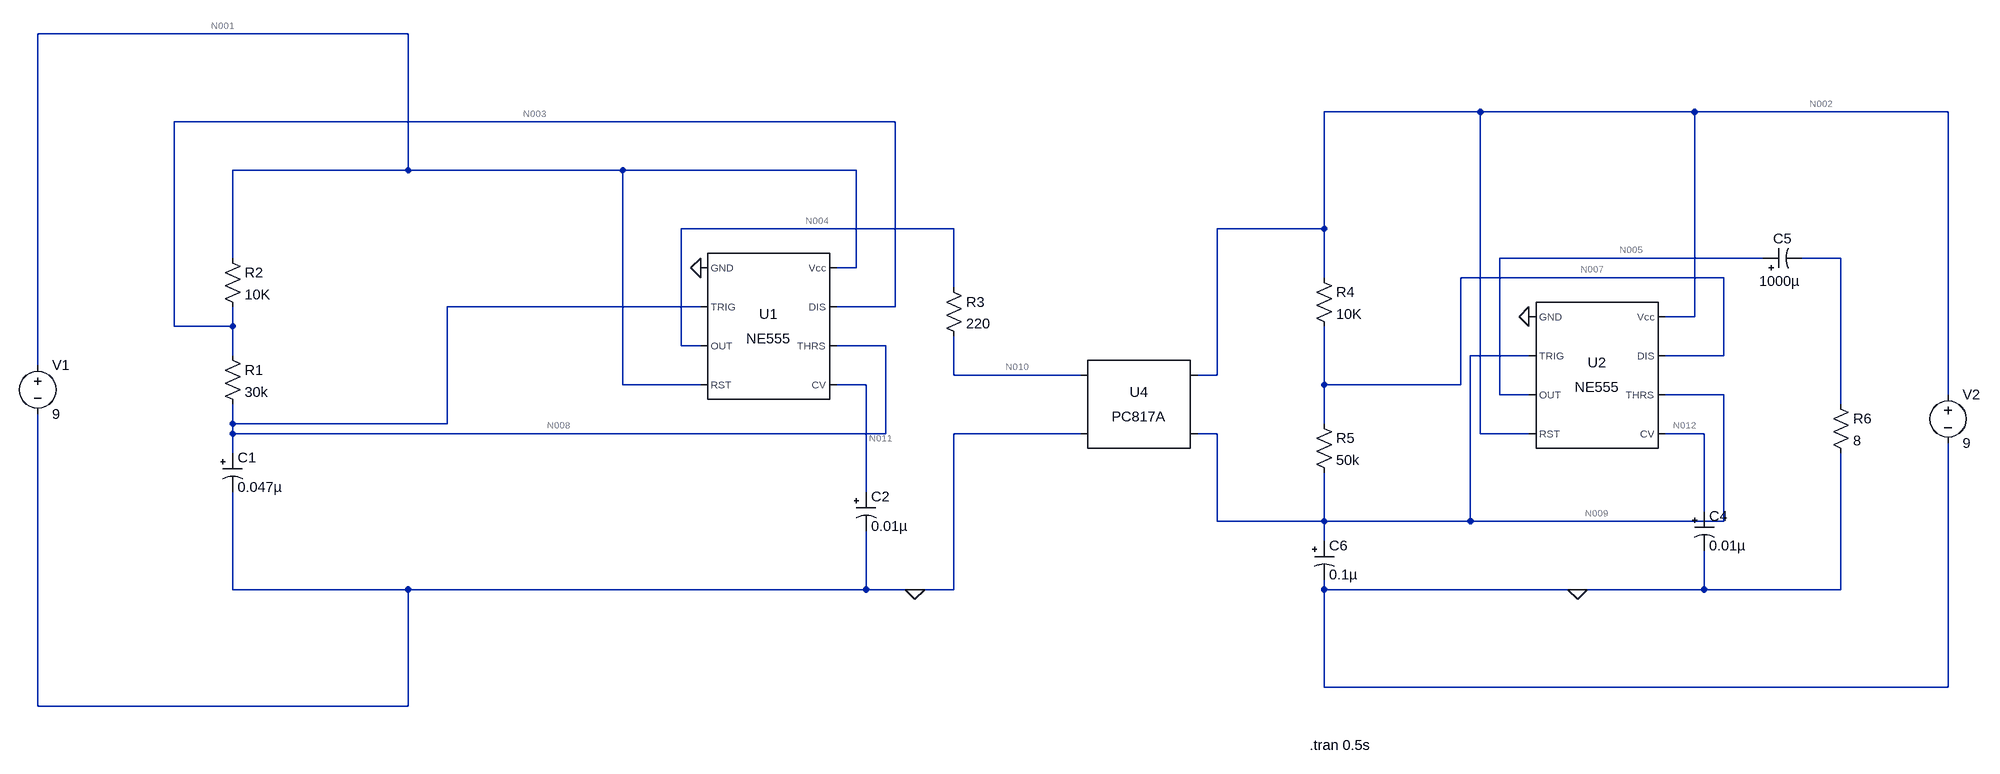
[diagram p0: schematic KR.asc]
KR.asc, the LTspice schematic file:
Version 4
SHEET 1 2916 848
WIRE -800 -336 -1408 -336
WIRE 960 -208 704 -208
WIRE 1312 -208 960 -208
WIRE 1728 -208 1312 -208
WIRE 0 -192 -1184 -192
WIRE -800 -112 -800 -336
WIRE -800 -112 -1088 -112
WIRE -448 -112 -800 -112
WIRE -64 -112 -448 -112
WIRE 96 -16 -352 -16
WIRE 704 -16 704 -208
WIRE 704 -16 528 -16
WIRE -1088 32 -1088 -112
WIRE 1424 32 992 32
WIRE 1552 32 1488 32
WIRE -64 48 -64 -112
WIRE -64 48 -96 48
WIRE 704 64 704 -16
WIRE 1360 64 928 64
WIRE 96 80 96 -16
WIRE -320 112 -736 112
WIRE 0 112 0 -192
WIRE 0 112 -96 112
WIRE 1312 128 1312 -208
WIRE 1312 128 1264 128
WIRE -1184 144 -1184 -192
WIRE -1088 144 -1088 112
WIRE -1088 144 -1184 144
WIRE -352 176 -352 -16
WIRE -320 176 -352 176
WIRE -16 176 -96 176
WIRE -1088 192 -1088 144
WIRE 1040 192 944 192
WIRE 1360 192 1360 64
WIRE 1360 192 1264 192
WIRE -1408 208 -1408 -336
WIRE 96 224 96 160
WIRE 304 224 96 224
WIRE 528 224 528 -16
WIRE 528 224 496 224
WIRE -448 240 -448 -112
WIRE -320 240 -448 240
WIRE -48 240 -96 240
WIRE 704 240 704 144
WIRE 928 240 928 64
WIRE 928 240 704 240
WIRE 992 256 992 32
WIRE 1040 256 992 256
WIRE 1360 256 1264 256
WIRE 1728 256 1728 -208
WIRE 1552 272 1552 32
WIRE -1088 304 -1088 272
WIRE -736 304 -736 112
WIRE -736 304 -1088 304
WIRE 704 304 704 240
WIRE -1088 320 -1088 304
WIRE -16 320 -16 176
WIRE -16 320 -1088 320
WIRE 304 320 96 320
WIRE 528 320 496 320
WIRE 960 320 960 -208
WIRE 1040 320 960 320
WIRE 1328 320 1264 320
WIRE -1088 352 -1088 320
WIRE -48 416 -48 240
WIRE 1328 448 1328 320
WIRE 528 464 528 320
WIRE 704 464 704 384
WIRE 704 464 528 464
WIRE 944 464 944 192
WIRE 944 464 704 464
WIRE 1360 464 1360 256
WIRE 1360 464 944 464
WIRE 704 496 704 464
WIRE -1088 576 -1088 416
WIRE -800 576 -1088 576
WIRE -48 576 -48 480
WIRE -48 576 -800 576
WIRE 32 576 -48 576
WIRE 96 576 96 320
WIRE 96 576 32 576
WIRE 704 576 704 560
WIRE 1120 576 704 576
WIRE 1328 576 1328 512
WIRE 1328 576 1120 576
WIRE 1552 576 1552 352
WIRE 1552 576 1328 576
WIRE 704 736 704 576
WIRE 1728 736 1728 336
WIRE 1728 736 704 736
WIRE -1408 768 -1408 288
WIRE -800 768 -800 576
WIRE -800 768 -1408 768
FLAG 32 576 0
FLAG 1120 576 0
FLAG -320 48 0
FLAG 1040 128 0
DATAFLAG 624 -16 ""
SYMBOL Misc\\NE555 -208 144 R0
SYMATTR InstName U1
SYMBOL Misc\\NE555 1152 224 R0
SYMATTR InstName U2
SYMBOL res -1104 176 R0
SYMATTR InstName R1
SYMATTR Value 30k
SYMBOL res -1104 16 R0
SYMATTR InstName R2
SYMATTR Value 10K
SYMATTR SpiceLine tol=1 pwr=0.1
SYMBOL res 80 64 R0
SYMATTR InstName R3
SYMATTR Value 220
SYMBOL polcap -1104 352 R0
WINDOW 3 24 56 Left 2
SYMATTR Value 0.047µ
SYMATTR InstName C1
SYMATTR Description Capacitor
SYMATTR Type cap
SYMATTR SpiceLine V=10 Irms=1.69 Rser=0.034 Lser=0
SYMBOL polcap -64 416 R0
WINDOW 3 24 56 Left 2
SYMATTR Value 0.01µ
SYMATTR InstName C2
SYMATTR Description Capacitor
SYMATTR Type cap
SYMATTR SpiceLine V=10 Irms=1.69 Rser=0.034 Lser=0
SYMBOL voltage -1408 192 R0
WINDOW 123 0 0 Left 0
WINDOW 39 0 0 Left 0
SYMATTR InstName V1
SYMATTR Value 9
SYMBOL polcap 1424 48 R270
WINDOW 0 32 32 VTop 2
WINDOW 3 -6 28 VBottom 2
SYMATTR InstName C5
SYMATTR Value 1000µ
SYMATTR Description Capacitor
SYMATTR Type cap
SYMATTR SpiceLine V=10 Irms=1.69 Rser=0.034 Lser=0
SYMBOL polcap 1312 448 R0
WINDOW 3 24 56 Left 2
SYMATTR Value 0.01µ
SYMATTR InstName C4
SYMATTR Description Capacitor
SYMATTR Type cap
SYMATTR SpiceLine V=10 Irms=1.69 Rser=0.034 Lser=0
SYMBOL voltage 1728 240 R0
WINDOW 123 0 0 Left 0
WINDOW 39 0 0 Left 0
SYMATTR InstName V2
SYMATTR Value 9
SYMBOL Optos\\PC817A 400 272 R0
SYMATTR InstName U4
SYMBOL res 1536 256 R0
SYMATTR InstName R6
SYMATTR Value 8
SYMBOL res 688 48 R0
SYMATTR InstName R4
SYMATTR Value 10K
SYMATTR SpiceLine tol=1 pwr=0.1
SYMBOL polcap 688 496 R0
WINDOW 3 24 56 Left 2
SYMATTR Value 0.1µ
SYMATTR InstName C6
SYMATTR Description Capacitor
SYMATTR Type cap
SYMATTR SpiceLine V=10 Irms=1.69 Rser=0.034 Lser=0
SYMBOL res 688 288 R0
SYMATTR InstName R5
SYMATTR Value 50k
SYMATTR SpiceLine tol=1 pwr=0.1
TEXT 680 832 Left 2 !.tran 0.5s

The netlist it stands for:
* KR.asc
XU1 0 N008 N004 N001 N011 N008 N003 N001 NE555  ; pins GND TRIG OUT RST CV THRS DIS Vcc
XU2 0 N009 N005 N002 N012 N009 N007 N002 NE555  ; pins GND TRIG OUT RST CV THRS DIS Vcc
R1 N003 N008 30k
R2 N001 N003 10K tol=1 pwr=0.1
R3 N004 N010 220
C1 N008 0 0.047µ V=10 Irms=1.69 Rser=0.034 Lser=0
C2 N011 0 0.01µ V=10 Irms=1.69 Rser=0.034 Lser=0
V1 N001 0 9
C5 N005 N006 1000µ V=10 Irms=1.69 Rser=0.034 Lser=0
C4 N012 0 0.01µ V=10 Irms=1.69 Rser=0.034 Lser=0
V2 N002 0 9
XU4 N010 0 N002 N009 PC817 Igain=1m
R6 N006 0 8
R4 N002 N007 10K tol=1 pwr=0.1
C6 N009 0 0.1µ V=10 Irms=1.69 Rser=0.034 Lser=0
R5 N007 N009 50k tol=1 pwr=0.1
.tran 0.5s
.lib NE555.sub
.lib PC817.sub
.backanno
.end

* Results of the author's LTspice run, read from the files saved beside the schematic
* Operating Point, zero values left out:
*   V(n008) = 8.999 V
*   V(n011) = 6 V
*   V(n001) = 9 V
*   V(n003) = 9 V
*   V(n004) = 8.792 V
*   V(n009) = 9 V
*   V(n012) = 6 V
*   V(n002) = 9 V
*   V(n007) = 9 V
*   V(n005) = 9 V
*   V(n010) = 1.173 V
*   I(R5) = -4.395 nA
*   I(R4) = 7.614 nA
*   I(R3) = 34.63 mA
*   I(R2) = 30.01 nA
*   I(R1) = 18 nA
*   I(V2) = -2.908 mA
*   I(V1) = -37.54 mA